# Altium project Control-Board-v1.0.PrjPcb (part 6 of 6)

## Sheet TFT_Display_Sheet.SchDoc
size 420 x 297 mm; SheetNumber: 6; SheetTotal: 11
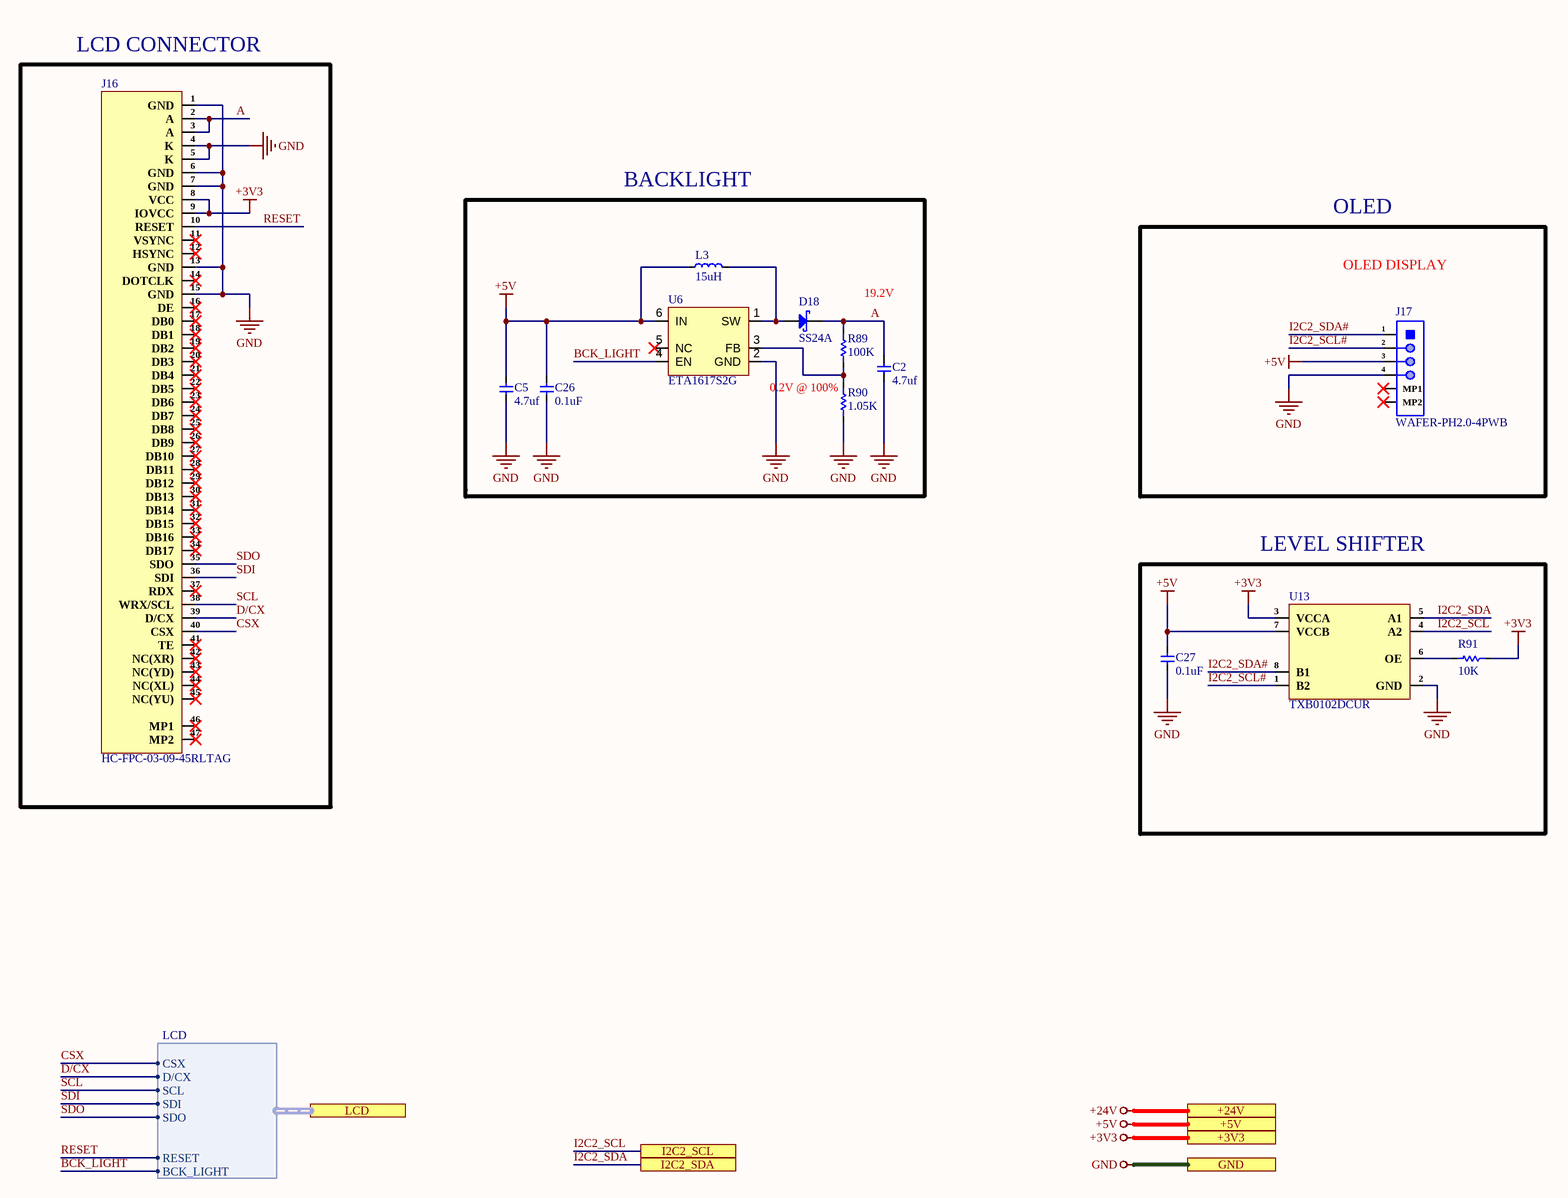
[diagram p10: TFT_Display_Sheet.SchDoc]

### Parts
C2  4.7uf  [Cap-0805]
C5  4.7uf  [Cap-0805]
C26  0.1uF  [Cap-0402]
C27  0.1uF  [Cap-0402]
D18  SS24A  [SMA]
J16  HC-FPC-03-09-45RLTAG  [HC-FPC-03-09-45RLTAG]
J17  WAFER-PH2.0-4PWB  [WAFER-PH2.0-4PWB]
L3  15uH  [FXL0530-150-M]
R89  100K  [Res-0402]
R90  1.05K  [Res-0402]
R91  10K  [Res-0402]
U6  ETA1617S2G  [SOT23-6]
U13  TXB0102DCUR  [VSSOP-8(3.1x2.1)]

### Blocks framed on the sheet
OLED DISPLAY: J17

### Ports
+3V3 (see Top_Sheet[5B], CAN_Sheet[5D], Connector_Sheet[5D], ESP32_Sheet[5D], EtherCAT_Sheet[5D], Ethernet_Sheet[5D], Power_Sheet[5D], RJ45_Sheet[5D], RS485_RS232_Sheet[5D], STM32_Sheet[5D]), +5V (see Top_Sheet[5B], CAN_Sheet[5D], Power_Sheet[5D]), +24V (see Top_Sheet[5B], Connector_Sheet[5D], Power_Sheet[5D]), GND (see Top_Sheet[5B], CAN_Sheet[5D], Connector_Sheet[5D], ESP32_Sheet[5D], EtherCAT_Sheet[5D], Ethernet_Sheet[5D], Power_Sheet[5D], RJ45_Sheet[5D], RS485_RS232_Sheet[5D], STM32_Sheet[5D]), I2C2_SCL (see Top_Sheet[5B], STM32_Sheet[2D]), I2C2_SDA (see Top_Sheet[5C], STM32_Sheet[2D]), LCD (harness LCD, see Top_Sheet[5B], STM32_Sheet[6D])

### Harnesses
LCD: CSX, D/CX, SCL, SDI, SDO, RESET, BCK_LIGHT

### Nets
+3V3: J16.8(VCC) J16.9(IOVCC) R91.2 U13.3(VCCA) ; port +3V3
+5V: C5.2 C26.2 C27.2 J17.3 L3.1 U6.6(IN) U13.7(VCCB) ; port +5V
GND: C2.1 C5.1 C26.1 C27.1 J16.1(GND) J16.4(K) J16.5(K) J16.6(GND) J16.7(GND) J16.13(GND) J16.15(GND) J17.4 R90.1 U6.2(GND) U13.2(GND) ; port GND
A: C2.2 D18.1(K) J16.2(A) J16.3(A) R89.2
BCK_LIGHT: U6.4(EN) ; port LCD.BCK_LIGHT
CSX: J16.40(CSX) ; port LCD.CSX
D/CX: J16.39(D/CX) ; port LCD.D/CX
I2C2_SCL: U13.4(A2) ; port I2C2_SCL
I2C2_SCL#: J17.2 U13.1(B2)
I2C2_SDA: U13.5(A1) ; port I2C2_SDA
I2C2_SDA#: J17.1 U13.8(B1)
RESET: J16.10(RESET) ; port LCD.RESET
SCL: J16.38(WRX/SCL) ; port LCD.SCL
SDI: J16.36(SDI) ; port LCD.SDI
SDO: J16.35(SDO) ; port LCD.SDO
NetD18_2: D18.2(A) L3.2 U6.1(SW)
NetR89_1: R89.1 R90.2 U6.3(FB)
NetR91_1: R91.1 U13.6(OE)

Not connected (* = marked no-connect by the designer): J16 11(VSYNC)* 12(HSYNC)* 14(DOTCLK)* 16(DE)* 17(DB0)* 18(DB1)* 19(DB2)* 20(DB3)* 21(DB4)* 22(DB5)* 23(DB6)* 24(DB7)* 25(DB8)* 26(DB9)* 27(DB10)* 28(DB11)* 29(DB12)* 30(DB13)* 31(DB14)* 32(DB15)* 33(DB16)* 34(DB17)* 37(RDX)* 41(TE)* 42(NC(XR))* 43(NC(YD))* 44(NC(XL))* 45(NC(YU))* 46(MP1)* 47(MP2)*; J17 MP1* MP2*; U6 5(NC)*

### Notes on the sheet
- (near J16) LCD CONNECTOR
- BACKLIGHT
- OLED
- 19.2V
- (near R90) 0.2V @ 100%
- LEVEL SHIFTER
- File:
- Title:
- Date:
- Page
- Num:
- Total:
- Drawn By: Huzaifa Ali

### Library data of the parts
C2 C5 = GRM21BR61H475KE51L: CAP CER 4.7UF 50V X5R 0805; Manufacturer: Murata; Material: Ceramic; Tolerance: 10%; Item Type: Capacitor; Supplier 1: Rs; Manufacturer Part Number: GRM21BR61H475KE51L; RoHS: Yes; Category: Ceramic Capacitors; Stock 1: 37300; Pricing 1: 500=0.09400, 1000=0.08800, 2000=0.08300, 5000=0.07500 (GBP); Mount: Surface Mount; Case/Package: 0805; Case Code (Metric): 2012; Case Code (Imperial): 0805; Min Operating Temperature: -55°C; Max Operating Temperature: 85°C; Capacitance: 4.7uF; Packaging: Tape and Reel; Dielectric: X5R; Voltage Rating: 50V; Voltage Rating (DC): 50V; Series: GRM; Length: 2mm; Width: 0.049inch; Height: 1.25mm; Thickness: 0.055inch; Depth: 1.25mm; Reach SVHC Compliant: Yes; Lead Free: Lead Free; RoHS Compliant: Yes; ComponentLink1URL: http://www.farnell.com/datasheets/2079186.pdf?src-supplier=Farnell; ComponentLink1Description: http://www.farnell.com/datasheets/2079186.pdf?src-supplier=Farnell; ComponentLink2URL: http://components.arrow.com/part/dataview/61084395S454511N2606?src-supplier=Arrow+Electronics; ComponentLink2Description: http://components.arrow.com/part/dataview/61084395S454511N2606?src-supplier=Arrow+Electronics; ComponentLink3URL: http://www.farnell.com/datasheets/2079186.pdf?src-supplier=Element14; ComponentLink3Description: http://www.farnell.com/datasheets/2079186.pdf?src-supplier=Element14; ComponentLink4URL: http://search.murata.co.jp/Ceramy/image/img/A01X/G101/ENG/GRM21BR61H475KE51-01.pdf?src-supplier=Digi-Key; ComponentLink4Description: http://search.murata.co.jp/Ceramy/image/img/A01X/G101/ENG/GRM21BR61H475KE51-01.pdf?src-supplier=Digi-Key; ComponentLink5URL: https://search.murata.co.jp/Ceramy/image/img/A01X/G101/ENG/GRM21BR61H475KE51-01.pdf?src-supplier=Digi-Key; ComponentLink5Description: https://search.murata.co.jp/Ceramy/image/img/A01X/G101/ENG/GRM21BR61H475KE51-01.pdf?src-supplier=Digi-Key; ComponentLink6URL: http://www.farnell.com/datasheets/2079186.pdf?src-supplier=Newark; ComponentLink6Description: http://www.farnell.com/datasheets/2079186.pdf?src-supplier=Newark; Supplier Part Number 1: 1138707P; LCSC Part Number: C162420
C26 C27 = C1005X5R1H104K050BB: CAP CER 0.1UF 50V X5R 0402; Manufacturer: TDK; Dielectric Material: Ceramic; Capacitance: 100nF; Tolerance: 10%; Item Type: Capacitor; Supplier 1: Digi-Key; Manufacturer Part Number: C1005X5R1H104K050BB; Stock 1: 1455182; Pricing 1: 1=0.12, 10=0.09, 50=0.049, 100=0.04, 500=0.02858, 1000=0.02245, 2500=0.02041, 5000=0.01878 (USD); Mount: Surface Mount; Case/Package: 0402; Case Code (Metric): 1005; Case Code (Imperial): 0402; Weight: 2.3E-05oz; Min Operating Temperature: -55°C; Max Operating Temperature: 85°C; Dielectric: X5R; Voltage Rating: 50V; Packaging: Tape and Reel; Voltage Rating (DC): 50V; Termination: SMD/SMT; Construction: Flat; Package Quantity: 1; Resistor Type: Ceramic; Voltage: 50V; Series: C; Length: 1mm; Width: 0.02inch; Height: 0.5mm; Depth: 0.5mm; Thickness: 0.022inch; Radiation Hardening: No; Lead Free: Lead Free; REACH SVHC: No SVHC; RoHS Compliant: Yes; ComponentLink1URL: https://product.tdk.com/info/en/catalog/spec/mlccspec_commercial_general_midvoltage_en.pdf?src-supplier=Digi-Key; ComponentLink1Description: https://product.tdk.com/info/en/catalog/spec/mlccspec_commercial_general_midvoltage_en.pdf?src-supplier=Digi-Key; ComponentLink2URL: http://www.tdk.co.jp/tefe02/e413_c.pdf?src-supplier=Future+Electronics; ComponentLink2Description: http://www.tdk.co.jp/tefe02/e413_c.pdf?src-supplier=Future+Electronics; ComponentLink3URL: https://www.verical.com/server-webapp/html/getDatasheet?partID=743571&src-supplier=Verical; ComponentLink3Description: https://www.verical.com/server-webapp/html/getDatasheet?partID=743571&src-supplier=Verical; ComponentLink4URL: http://www.tdk.co.jp/tefe02/e412_c.pdf?src-supplier=Avnet+Europe; ComponentLink4Description: http://www.tdk.co.jp/tefe02/e412_c.pdf?src-supplier=Avnet+Europe; Supplier Part Number 1: 445-5942-1-ND; LCSC Part Number: C2181865
D18 = SS24A: 40V 500mV@2A 2A SMA(DO-214AC) Schottky Barrier Diodes (SBD) ROHS; Manufacturer: Guangdong Hottech; Manufacturer Part Number: SS24A; Package: SMA(DO-214AC); LCSC Part Number: C2886579; ComponentLink1Description: LCSC; ComponentLink1URL: https://www.lcsc.com/product-detail/Schottky-Barrier-Diodes-SBD_Guangdong-Hottech-SS24A_C2886579.html
J16 = HC-FPC-03-09-45RLTAG: -55℃~+85℃ Clamshell 45P Bottom Contact Surface Mount，Right Angle 0.3mm SMD,P=0.3mm,Surface Mount，Right Angle FFC/FPC Connectors ROHS; Manufacturer: HCTL; Manufacturer Part Number: HC-FPC-03-09-45RLTAG; Package: SMD,P=0.3mm,Surface Mount，Right Angle; LCSC Part Number: C5213725; Item Type: FFC/FPC Connector; ComponentLink1Description: LCSC; ComponentLink1URL: https://www.lcsc.com/product-detail/FFC-FPC-Connectors_HCTL-HC-FPC-03-09-45RLTAG_C5213725.html
J17 = WAFER-PH2.0-4PWB: 1x4P 1 2mm Male pin 4 -25℃~+85℃ 2A Surface Mount SMD,P=2mm Wire To Board / Wire To Wire Connector ROHS / C3029442; Manuacturer: XUNPU; Manufacturer Part Number: WAFER-PH2.0-4PWB; LCSC Part Number: C3029442; Item Type: Connector; ComponentLink1Description: LCSC; ComponentLink1URL: https://www.lcsc.com/product-detail/Wire-To-Board-Wire-To-Wire-Connector_XUNPU-WAFER-PH2-0-4PWB_C3029442.html
L3 = FXL0530-150-M: 1.7A 15uH Molding Choke ±20% 2.2A SMD,5.2x5.4mm Power Inductors ROHS; Manufacturer: cjiang; Manufacturer Part Number: FXL0530-150-M; Package: SMD,5.2x5.4mm; LCSC Part Number: C7471117; Item Type: Inductor; ComponentLink1Description: LCSC; ComponentLink1URL: https://www.lcsc.com/product-detail/Power-Inductors_cjiang-Changjiang-Microelectronics-Tech-FXL0530-150-M_C7471117.html
R89 = RC0402FR-07100KL: RES 100K OHM 1% 1/16W 0402; Manufacturer: Yageo; Resistance: 100kR; Temperature Coefficient: 100ppm/°C; Power Rating: 63mW; Voltage Rating: 50V; Item Type: Resistor; Supplier 1: Mouser; Manufacturer Part Number: RC0402FR-07100KL; RoHS: Yes; Category: Chip SMD Resistors; Stock 1: 7759549; Pricing 1: 1=0.10000, 10=0.01200, 50=0.01200, 100=0.00500, 1000=0.00300, 2500=0.00200, 10000=0.00100 (USD); Case/Package: 0402; Case Code (Metric): 1005; Case Code (Imperial): 0402; Min Operating Temperature: -55°C; Max Operating Temperature: 155°C; Resistor Type: Thick Film; Tolerance: 1%; Packaging: Tape and Reel; Package Quantity: 1; Number of Terminations: 2; Termination: SMD/SMT; Max Power Dissipation: 63mW; Working Voltage: 50V; Features: Moisture Resistant; Series: RC; Resistance Tolerance: 1%; Construction: Rectangular; Technology: THICK FILM; Length: 0.039inch; Width: 0.02inch; Height: 0.016inch; Depth: 0.5mm; REACH SVHC: No SVHC; Lead Free: Lead Free; RoHS Compliant: Yes; Military Standard: Not; ComponentLink1URL: https://datasheet.ciiva.com/11819/0900766b80c66297-11819452.pdf?src-supplier=RSComponents; ComponentLink1Description: https://datasheet.ciiva.com/11819/0900766b80c66297-11819452.pdf?src-supplier=RSComponents; ComponentLink2URL: https://datasheet.ciiva.com/22747/1018594-22747509.pdf?src-supplier=Element14; ComponentLink2Description: https://datasheet.ciiva.com/22747/1018594-22747509.pdf?src-supplier=Element14; ComponentLink3URL: https://datasheet.ciiva.com/2453/pyu-r-int-thick-7-2453362.pdf?src-supplier=Digi-Key; ComponentLink3Description: https://datasheet.ciiva.com/2453/pyu-r-int-thick-7-2453362.pdf?src-supplier=Digi-Key; ComponentLink4URL: https://datasheet.ciiva.com/2453/pyu-r-int-thick-7-2453363.pdf?src-supplier=Digi-Key; ComponentLink4Description: https://datasheet.ciiva.com/2453/pyu-r-int-thick-7-2453363.pdf?src-supplier=Digi-Key; ComponentLink5URL: https://datasheet.ciiva.com/2453/pyu-r-int-thick-7-2453361.pdf?src-supplier=Digi-Key; ComponentLink5Description: https://datasheet.ciiva.com/2453/pyu-r-int-thick-7-2453361.pdf?src-supplier=Digi-Key; ComponentLink6URL: https://datasheet.ciiva.com/12667/pyu-rc0402-51-rohs-l-6-r-12667930.pdf?src-supplier=Mouser; ComponentLink6Description: https://datasheet.ciiva.com/12667/pyu-rc0402-51-rohs-l-6-r-12667930.pdf?src-supplier=Mouser; ComponentLink7URL: https://datasheet.ciiva.com/15189/getdatasheetpartid-323696-15189334.pdf?src-supplier=Verical; ComponentLink7Description: https://datasheet.ciiva.com/15189/getdatasheetpartid-323696-15189334.pdf?src-supplier=Verical; Supplier Part Number 1: 603-RC0402FR-07100KL; LCSC Part Number: C60491
R90 = 0402WGF1051TCE: 62.5mW Thick Film Resistors 50V ±100ppm/℃ ±1% 1.05kΩ 0402 Chip Resistor - Surface Mount ROHS; Manufacturer: UNI-Royal; Manufacturer Part Number: 0402WGF1051TCE; LCSC Part Number: C474080; Item Type: Resistor; Package: 0402; ComponentLink1Description: LCSC Link; ComponentLink1URL: https://www.lcsc.com/product-detail/Chip-Resistor-Surface-Mount_UNI-ROYAL-Uniroyal-Elec-0402WGF1051TCE_C474080.html
R91 = RC0402FR-0710KL: RES 10K OHM 1% 1/16W 0402; Manufacturer: Yageo; Resistance: 10kR; Voltage Rating (DC): 50V; Temperature Coefficient: 100ppm/°C; Power Rating: 62.5mW; Max Power Dissipation: 63mW; Item Type: Resistor; Supplier 1: Mouser; Manufacturer Part Number: RC0402FR-0710KL; RoHS: Yes; Category: Chip SMD Resistors; Stock 1: 18648329; Pricing 1: 1=0.10000, 10=0.01400, 50=0.01400, 100=0.00500, 1000=0.00300, 10000=0.00200 (USD); Case/Package: 0402; Number of Pins: 2; Case Code (Imperial): 0402; Case Code (Metric): 1005; Min Operating Temperature: -55°C; Max Operating Temperature: 155°C; Resistor Type: Thick Film; Tolerance: 1%; Packaging: Tape and Reel; Voltage Rating: 50V; Termination: SMD/SMT; Working Voltage: 50V; Number of Terminations: 2; Features: Moisture Resistant; Series: RC; Resistance Tolerance: 1%; Construction: Rectangular; Length: 1mm; Width: 0.5mm; Height: 0.32mm; Depth: 0.5mm; Lead Pitch: 0.2mm; REACH SVHC: No SVHC; Lead Free: Lead Free; RoHS Compliant: Yes; Military Standard: Not; ComponentLink1URL: https://datasheet.ciiva.com/7660/38568-7660787.pdf?src-supplier=Element14; ComponentLink1Description: https://datasheet.ciiva.com/7660/38568-7660787.pdf?src-supplier=Element14; ComponentLink2URL: https://datasheet.ciiva.com/7849/1686128-7849814.pdf?src-supplier=Element14; ComponentLink2Description: https://datasheet.ciiva.com/7849/1686128-7849814.pdf?src-supplier=Element14; ComponentLink3URL: https://datasheet.ciiva.com/7983/1018594-7983486.pdf?src-supplier=Element14; ComponentLink3Description: https://datasheet.ciiva.com/7983/1018594-7983486.pdf?src-supplier=Element14; ComponentLink4URL: https://datasheet.ciiva.com/22747/1018594-22747512.pdf?src-supplier=Element14; ComponentLink4Description: https://datasheet.ciiva.com/22747/1018594-22747512.pdf?src-supplier=Element14; ComponentLink5URL: https://datasheet.ciiva.com/12667/pyu-rc0402-51-rohs-l-6-r-12667067.pdf?src-supplier=Mouser; ComponentLink5Description: https://datasheet.ciiva.com/12667/pyu-rc0402-51-rohs-l-6-r-12667067.pdf?src-supplier=Mouser; ComponentLink6URL: https://datasheet.ciiva.com/7849/1784430-7849813.pdf?src-supplier=Element14; ComponentLink6Description: https://datasheet.ciiva.com/7849/1784430-7849813.pdf?src-supplier=Element14; ComponentLink7URL: https://datasheet.ciiva.com/7849/1784430-7849815.pdf?src-supplier=Element14; ComponentLink7Description: https://datasheet.ciiva.com/7849/1784430-7849815.pdf?src-supplier=Element14; Supplier Part Number 1: 603-RC0402FR-0710KL; LCSC Part Number: C60490
U6 = ETA1617S2G: SOT23-6 LED Drivers ROHS; Manufacturer: etasolutions; Manufacturer Part Number: ETA1617S2G; LCSC Part Number: C7465515; Item Type: LED Driver; Package: SOT23-6; ComponentLink1Description: LCSC Link; ComponentLink1URL: https://www.lcsc.com/product-detail/LED-Drivers_etasolution-ETA1617S2G_C7465515.html
U13 = TXB0102DCUR: IC TRANSLTR BIDIRECTIONAL 8VSSOP; Manufacturer: Texas Instruments; Number of Circuits: 1; Nominal Supply Current: 3.5uA; Number of Inputs: 1NUMBER; Max Supply Voltage: 5.5V; Min Supply Voltage: 1.2V; Propagation Delay: 7.4ns; Data Rate: 100Mbps; Logic Function: Translator; Number of Bits: 2; Turn-On Delay Time: 31ns; High Level Output Current: -20uA; Low Level Output Current: 20uA; Output Type: 3-STATE; Supplier: Digikey; Supplier Part Number: 296-22862-1-ND; Manufacturer Part Number: TXB0102DCUR; RoHS: Yes; Category: Voltage Level Shifters; Stock: 10593; Pricing: 1=0.69, 10=0.606, 25=0.5696, 100=0.4649, 250=0.4318, 500=0.36748, 1000=0.29398 (USD); Mounting Technology: Surface Mount; Case/Package: VSSOP; Pins: 8; Weight: 0.000339oz; Min Operating Temperature: -40°C; Max Operating Temperature: 85°C; Number of Outputs: 1NUMBER; Packaging: Tape and Reel; Package Quantity: 3000; Series: -; Channel Type: Bidirectional; Length: 2.3mm; Width: 2mm; Height: 900um; Thickness: 850um; Radiation Hardening: No; Reach SVHC Compliant: No; Lead Free: Lead Free; RoHS Compliant: Yes; ComponentLink1URL: https://datasheet.ciiva.com/7744/1634161-7744195.pdf?src-supplier=Element14; ComponentLink1Description: https://datasheet.ciiva.com/7744/1634161-7744195.pdf?src-supplier=Element14; ComponentLink2URL: https://datasheet.ciiva.com/22677/1699360-22677930.pdf?src-supplier=Element14; ComponentLink2Description: https://datasheet.ciiva.com/22677/1699360-22677930.pdf?src-supplier=Element14; ComponentLink3URL: https://datasheet.ciiva.com/4226/sces641b-4226960.pdf?src-supplier=Arrow+Electronics; ComponentLink3Description: https://datasheet.ciiva.com/4226/sces641b-4226960.pdf?src-supplier=Arrow+Electronics; ComponentLink4URL: https://datasheet.ciiva.com/15096/getdatasheetpartid-214907-15096235.pdf?src-supplier=Verical; ComponentLink4Description: https://datasheet.ciiva.com/15096/getdatasheetpartid-214907-15096235.pdf?src-supplier=Verical; ComponentLink5URL: https://datasheet.ciiva.com/6132/txb0102-6132717.pdf?src-supplier=Farnell; ComponentLink5Description: https://datasheet.ciiva.com/6132/txb0102-6132717.pdf?src-supplier=Farnell; ComponentLink6URL: https://datasheet.ciiva.com/46384/1874809-46384198.pdf?src-supplier=Element14; ComponentLink6Description: https://datasheet.ciiva.com/46384/1874809-46384198.pdf?src-supplier=Element14; ComponentLink7URL: https://datasheet.ciiva.com/1899/txb0102-1899430.pdf?src-supplier=Digikey; ComponentLink7Description: https://datasheet.ciiva.com/1899/txb0102-1899430.pdf?src-supplier=Digikey; ComponentLink8URL: https://datasheet.ciiva.com/1899/txb0102-1899429.pdf?src-supplier=Digikey; ComponentLink8Description: https://datasheet.ciiva.com/1899/txb0102-1899429.pdf?src-supplier=Digikey; ComponentLink9URL: https://datasheet.ciiva.com/1899/txb0102-1899431.pdf?src-supplier=Digikey; ComponentLink9Description: https://datasheet.ciiva.com/1899/txb0102-1899431.pdf?src-supplier=Digikey; ComponentLink10URL: https://datasheet.ciiva.com/14287/txb0102-14287496.pdf?src-supplier=Avnet; ComponentLink10Description: https://datasheet.ciiva.com/14287/txb0102-14287496.pdf?src-supplier=Avnet; LCSC Part Number: C60709; Type: IC; ComponentLink11Description: LCSC; ComponentLink11URL: https://www.lcsc.com/product-detail/Translators-Level-Shifters_Texas-Instruments-TXB0102DCUR_C60709.html

## Nets that join several sheets
+3V3: CAN_Sheet (C23.2 U5.5), ESP32_Sheet (7 pins), EtherCAT_Sheet (19 pins), Ethernet_Sheet (C67.2 Q2.2 R73.2), Power_Sheet (5 pins), RJ45_Sheet (12 pins), RS485_RS232_Sheet (16 pins), STM32_Sheet (11 pins), TFT_Display_Sheet (J16.8 J16.9 R91.2 U13.3)
+5V: CAN_Sheet (5 pins), Power_Sheet (7 pins), TFT_Display_Sheet (7 pins)
+24V: Connector_Sheet (J24.2), Power_Sheet (10 pins)
CAN_RX: CAN_Sheet (TP5.1 U5.4), STM32_Sheet (U2.15)
CAN_TX: CAN_Sheet (TP6.1 U5.1), STM32_Sheet (U2.16)
CHASIS GND: Ethernet_Sheet (J21.8 J21.Shield 1 J21.Shield 2), RJ45_Sheet (7 pins)
GND: CAN_Sheet (7 pins), Connector_Sheet (J24.1 J25.3), ESP32_Sheet (26 pins), EtherCAT_Sheet (26 pins), Ethernet_Sheet (33 pins), Power_Sheet (22 pins), RJ45_Sheet (10 pins), RS485_RS232_Sheet (20 pins), STM32_Sheet (28 pins), TFT_Display_Sheet (15 pins)
RE/DE/RS485/T: RS485_RS232_Sheet (5 pins), STM32_Sheet (U2.20)
RE/DE/RS485/T_2: RS485_RS232_Sheet (5 pins), STM32_Sheet (U2.19)
RS232_RX: Connector_Sheet (J27.1), RS485_RS232_Sheet (F7.1 TP7.1)
RS232_RX_2: Connector_Sheet (J23.1), RS485_RS232_Sheet (F4.1 TP13.1)
RS232_TX: Connector_Sheet (J27.2), RS485_RS232_Sheet (F8.1 TP8.1)
RS232_TX_2: Connector_Sheet (J23.2), RS485_RS232_Sheet (F3.1 TP14.1)
RXD/RS485: RS485_RS232_Sheet (R40.1 TP9.1 U9.4), STM32_Sheet (U2.21)
RXD/RS485_2: RS485_RS232_Sheet (R29.1 TP15.1 U7.4), STM32_Sheet (U2.17)
TXD/RS485: RS485_RS232_Sheet (R37.1 TP10.1 U9.1), STM32_Sheet (U2.22)
TXD/RS485_2: RS485_RS232_Sheet (R26.1 TP16.1 U7.1), STM32_Sheet (U2.18)
W5500_RST: ESP32_Sheet (U1.18), Ethernet_Sheet (R83.2 U11.37)
BCK_LIGHT: STM32_Sheet (U2.63), TFT_Display_Sheet (U6.4)
CAN_N: CAN_Sheet (R25.2 U5.12), Connector_Sheet (J25.2)
CAN_P: CAN_Sheet (R23.1 U5.13), Connector_Sheet (J25.1)
CSX: STM32_Sheet (U2.60), TFT_Display_Sheet (J16.40)
D/CX: STM32_Sheet (U2.61), TFT_Display_Sheet (J16.39)
EN_CAN: CAN_Sheet (U5.6), STM32_Sheet (U2.36)
I2C2_SCL: STM32_Sheet (U2.33), TFT_Display_Sheet (U13.4)
I2C2_SDA: STM32_Sheet (U2.34), TFT_Display_Sheet (U13.5)
INH_MASK: CAN_Sheet (U5.11), STM32_Sheet (U2.35)
LEDPOL0: EtherCAT_Sheet (R56.2 U10.48), RJ45_Sheet (R65.1)
LEDPOL1: EtherCAT_Sheet (R57.2 U10.46), RJ45_Sheet (R71.1)
nFAULT_CAN: CAN_Sheet (U5.8), STM32_Sheet (U2.39)
nSTB_CAN: CAN_Sheet (U5.14), STM32_Sheet (U2.38)
RESET: STM32_Sheet (U2.62), TFT_Display_Sheet (J16.10)
RS485/2_N: Connector_Sheet (J22.1), RS485_RS232_Sheet (F1.2)
RS485/2_P: Connector_Sheet (J22.2), RS485_RS232_Sheet (F2.2)
RS485_N: Connector_Sheet (J26.1), RS485_RS232_Sheet (F5.2)
RS485_P: Connector_Sheet (J26.2), RS485_RS232_Sheet (F6.2)
RXA_N: EtherCAT_Sheet (U10.54), RJ45_Sheet (C53.2 J19.6 R58.1)
RXA_P: EtherCAT_Sheet (U10.55), RJ45_Sheet (C54.2 J19.3 R59.1)
RXB_N: EtherCAT_Sheet (U10.61), RJ45_Sheet (C59.2 J20.6 R66.1)
RXB_P: EtherCAT_Sheet (U10.60), RJ45_Sheet (C60.2 J20.3 R67.1)
RXD/RS232: RS485_RS232_Sheet (U8.9), STM32_Sheet (U2.56)
RXD/RS232_2: RS485_RS232_Sheet (U8.12), STM32_Sheet (U2.41)
SCL: STM32_Sheet (U2.57), TFT_Display_Sheet (J16.38)
SDI: STM32_Sheet (U2.59), TFT_Display_Sheet (J16.36)
SDO: STM32_Sheet (U2.58), TFT_Display_Sheet (J16.35)
SPI2_CS_IO5: ESP32_Sheet (U1.5), Ethernet_Sheet (U11.32)
SPI2_MISO: EtherCAT_Sheet (U10.13), STM32_Sheet (U2.53)
SPI2_MISO_IO1: ESP32_Sheet (U1.39), Ethernet_Sheet (U11.34)
SPI2_MOSI: EtherCAT_Sheet (U10.17), STM32_Sheet (U2.54)
SPI2_MOSI_IO2: ESP32_Sheet (U1.38), Ethernet_Sheet (U11.35)
SPI2_NSS: EtherCAT_Sheet (U10.50), STM32_Sheet (U2.50)
SPI2_SCK: EtherCAT_Sheet (U10.19), STM32_Sheet (U2.51)
SPI2_SCK_IO4: ESP32_Sheet (U1.4), Ethernet_Sheet (U11.33)
SYNC0: EtherCAT_Sheet (U10.34), STM32_Sheet (U2.30)
SYNC1: EtherCAT_Sheet (U10.18), STM32_Sheet (U2.29)
TXA_N: EtherCAT_Sheet (U10.52), RJ45_Sheet (C55.2 J19.2 R60.1)
TXA_P: EtherCAT_Sheet (U10.53), RJ45_Sheet (C56.2 J19.1 R61.1)
TXB_N: EtherCAT_Sheet (U10.63), RJ45_Sheet (C61.2 J20.2 R68.1)
TXB_P: EtherCAT_Sheet (U10.62), RJ45_Sheet (C62.2 J20.1 R69.1)
TXD/RS232: RS485_RS232_Sheet (U8.10), STM32_Sheet (U2.55)
TXD/RS232_2: RS485_RS232_Sheet (U8.11), STM32_Sheet (U2.40)
USART5_RX: ESP32_Sheet (U1.17), STM32_Sheet (U2.28)
USART5_TX: ESP32_Sheet (U1.12), STM32_Sheet (U2.27)
W5500_INT: ESP32_Sheet (U1.19), Ethernet_Sheet (R81.2 U11.36)
W5500_PWR_EN: ESP32_Sheet (U1.20), Ethernet_Sheet (Q1.1)